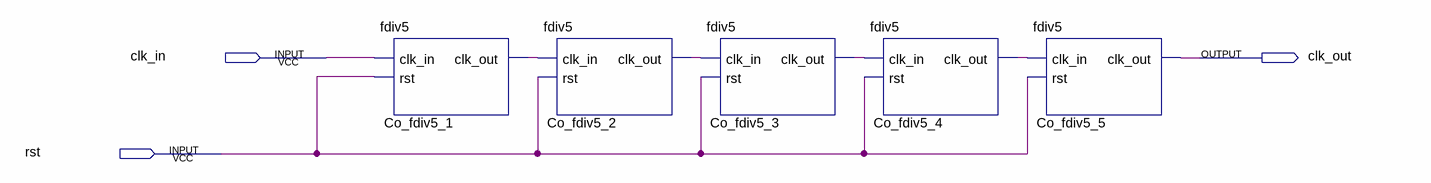
[diagram p0: schematic sheet]
// Quartus schematic fdiv25.bdf as structural Verilog: 5 symbols, 3 pins
module fdiv25 (
  input  clk_in,
  input  rst,
  output clk_out
);

  wire Co_fdiv5_1_clk_out, Co_fdiv5_2_clk_out, Co_fdiv5_3_clk_out, Co_fdiv5_4_clk_out;

  fdiv5 Co_fdiv5_1 (.clk_in(clk_in), .rst(rst), .clk_out(Co_fdiv5_1_clk_out));
  fdiv5 Co_fdiv5_2 (.clk_in(Co_fdiv5_1_clk_out), .rst(rst), .clk_out(Co_fdiv5_2_clk_out));
  fdiv5 Co_fdiv5_3 (.clk_in(Co_fdiv5_2_clk_out), .rst(rst), .clk_out(Co_fdiv5_3_clk_out));
  fdiv5 Co_fdiv5_4 (.clk_in(Co_fdiv5_3_clk_out), .rst(rst), .clk_out(Co_fdiv5_4_clk_out));
  fdiv5 Co_fdiv5_5 (.clk_in(Co_fdiv5_4_clk_out), .rst(rst), .clk_out(clk_out));
endmodule
